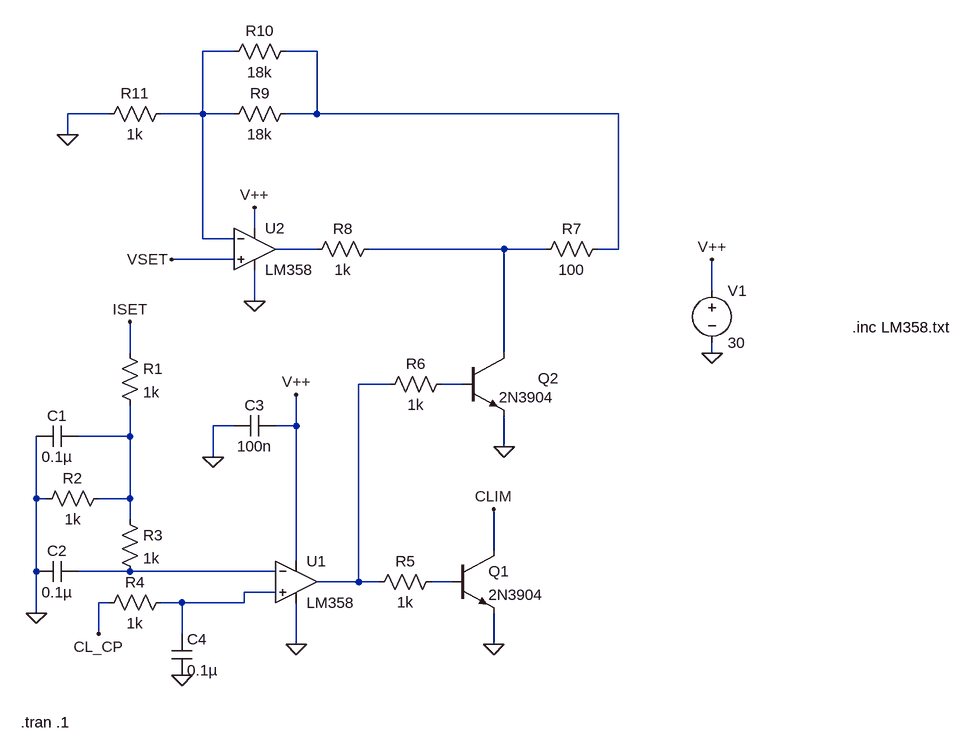
[diagram p0: schematic Part 1 Circuit.asc]
Part 1 Circuit.asc, the LTspice schematic file:
Version 4
SHEET 1 2464 680
WIRE 288 -368 240 -368
WIRE 416 -368 368 -368
WIRE 96 -272 32 -272
WIRE 240 -272 240 -368
WIRE 240 -272 176 -272
WIRE 288 -272 240 -272
WIRE 416 -272 416 -368
WIRE 416 -272 368 -272
WIRE 880 -272 416 -272
WIRE 32 -240 32 -272
WIRE 320 -96 320 -128
WIRE 240 -80 240 -272
WIRE 288 -80 240 -80
WIRE 416 -64 352 -64
WIRE 704 -64 496 -64
WIRE 768 -64 704 -64
WIRE 880 -64 880 -272
WIRE 880 -64 848 -64
WIRE 288 -48 192 -48
WIRE 1024 0 1024 -48
WIRE 320 16 320 -32
WIRE 128 96 128 48
WIRE 704 96 704 -64
WIRE 1024 96 1024 80
WIRE 528 144 480 144
WIRE 640 144 608 144
WIRE 288 208 256 208
WIRE 384 208 384 160
WIRE 384 208 352 208
WIRE 128 224 128 176
WIRE 128 224 48 224
WIRE 704 240 704 192
WIRE 256 256 256 208
WIRE -16 320 -16 224
WIRE 0 320 -16 320
WIRE 128 320 128 224
WIRE 128 320 80 320
WIRE 128 352 128 320
WIRE 688 400 688 336
WIRE 384 416 384 208
WIRE -16 432 -16 320
WIRE 128 432 48 432
WIRE 352 432 128 432
WIRE 480 448 480 144
WIRE 480 448 416 448
WIRE 512 448 480 448
WIRE 624 448 592 448
WIRE 352 464 304 464
WIRE 96 480 80 480
WIRE 208 480 176 480
WIRE 304 480 304 464
WIRE 304 480 208 480
WIRE -16 496 -16 432
WIRE 80 528 80 480
WIRE 208 528 208 480
WIRE 384 544 384 480
WIRE 688 544 688 496
FLAG -16 496 0
FLAG 256 256 0
FLAG 384 544 0
FLAG 208 592 0
FLAG 688 544 0
FLAG 704 240 0
FLAG 32 -240 0
FLAG 320 16 0
FLAG 320 -128 V++
FLAG 384 160 V++
FLAG 1024 96 0
FLAG 1024 -48 V++
FLAG 192 -48 VSET
FLAG 128 48 ISET
FLAG 80 528 CL_CP
FLAG 688 336 CLIM
SYMBOL res 112 80 R0
SYMATTR InstName R1
SYMATTR Value 1k
SYMBOL cap 48 208 R90
WINDOW 0 0 32 VBottom 2
WINDOW 3 32 32 VTop 2
SYMATTR InstName C1
SYMATTR Value 0.1µ
SYMBOL res 96 304 R90
WINDOW 0 0 56 VBottom 2
WINDOW 3 32 56 VTop 2
SYMATTR InstName R2
SYMATTR Value 1k
SYMBOL cap 48 416 R90
WINDOW 0 0 32 VBottom 2
WINDOW 3 32 32 VTop 2
SYMATTR InstName C2
SYMATTR Value 0.1µ
SYMBOL res 112 336 R0
SYMATTR InstName R3
SYMATTR Value 1k
SYMBOL Opamps\\opamp2 384 384 R0
SYMATTR InstName U1
SYMATTR Value LM358
SYMBOL cap 352 192 R90
WINDOW 0 0 32 VBottom 2
WINDOW 3 32 32 VTop 2
SYMATTR InstName C3
SYMATTR Value 100n
SYMBOL res 192 464 R90
WINDOW 0 0 56 VBottom 2
WINDOW 3 32 56 VTop 2
SYMATTR InstName R4
SYMATTR Value 1k
SYMBOL cap 192 528 R0
SYMATTR InstName C4
SYMATTR Value 0.1µ
SYMBOL res 608 432 R90
WINDOW 0 0 56 VBottom 2
WINDOW 3 32 56 VTop 2
SYMATTR InstName R5
SYMATTR Value 1k
SYMBOL npn 624 400 R0
SYMATTR InstName Q1
SYMATTR Value 2N3904
SYMBOL res 624 128 R90
WINDOW 0 0 56 VBottom 2
WINDOW 3 32 56 VTop 2
SYMATTR InstName R6
SYMATTR Value 1k
SYMBOL npn 640 96 R0
WINDOW 0 116 39 Left 2
SYMATTR InstName Q2
SYMATTR Value 2N3904
SYMBOL res 864 -80 R90
WINDOW 0 0 56 VBottom 2
WINDOW 3 32 56 VTop 2
SYMATTR InstName R7
SYMATTR Value 100
SYMBOL res 512 -80 R90
WINDOW 0 0 56 VBottom 2
WINDOW 3 32 56 VTop 2
SYMATTR InstName R8
SYMATTR Value 1k
SYMBOL Opamps\\opamp2 320 -128 R0
SYMATTR InstName U2
SYMATTR Value LM358
SYMBOL res 384 -288 R90
WINDOW 0 0 56 VBottom 2
WINDOW 3 32 56 VTop 2
SYMATTR InstName R9
SYMATTR Value 18k
SYMBOL res 384 -384 R90
WINDOW 0 0 56 VBottom 2
WINDOW 3 32 56 VTop 2
SYMATTR InstName R10
SYMATTR Value 18k
SYMBOL res 192 -288 R90
WINDOW 0 0 56 VBottom 2
WINDOW 3 32 56 VTop 2
SYMATTR InstName R11
SYMATTR Value 1k
SYMBOL voltage 1024 -16 R0
WINDOW 123 0 0 Left 2
WINDOW 39 0 0 Left 2
SYMATTR InstName V1
SYMATTR Value 30
TEXT 1240 56 Left 2 !.inc LM358.txt
TEXT -40 664 Left 2 !.tran .1

The netlist it stands for:
* Part 1 Circuit.asc
R1 ISET N007 1k
C1 N007 0 0.1µ
R2 N007 0 1k
C2 N008 0 0.1µ
R3 N007 N008 1k
XU1 N010 N008 V++ 0 N005 LM358  ; pins In+ In- V+ V- OUT
C3 V++ 0 100n
R4 N010 CL_CP 1k
C4 N010 0 0.1µ
R5 N009 N005 1k
Q1 CLIM N009 0 0 2N3904
R6 N006 N005 1k
Q2 N004 N006 0 0 2N3904
R7 N002 N004 100
R8 N004 N003 1k
XU2 VSET N001 V++ 0 N003 LM358  ; pins In+ In- V+ V- OUT
R9 N002 N001 18k
R10 N002 N001 18k
R11 N001 0 1k
V1 V++ 0 30
.model NPN NPN
.model PNP PNP
.lib standard.bjt
.inc LM358.txt
.tran .1
.backanno
.end